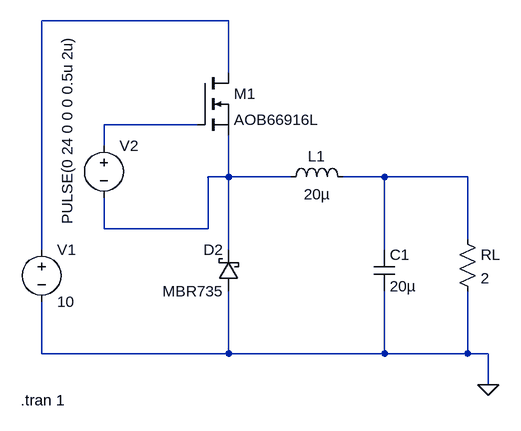
[diagram p0: schematic Buck Converter Open Loop.asc]
Buck Converter Open Loop.asc, the LTspice schematic file:
Version 4
SHEET 1 880 756
WIRE 320 -224 32 -224
WIRE 320 -144 320 -224
WIRE 272 -64 128 -64
WIRE 128 -32 128 -64
WIRE 320 16 320 -48
WIRE 320 16 288 16
WIRE 416 16 320 16
WIRE 560 16 496 16
WIRE 688 16 560 16
WIRE 128 96 128 48
WIRE 288 96 288 16
WIRE 288 96 128 96
WIRE 688 112 688 16
WIRE 32 128 32 -224
WIRE 320 128 320 16
WIRE 560 128 560 16
WIRE 32 288 32 208
WIRE 320 288 320 192
WIRE 320 288 32 288
WIRE 560 288 560 192
WIRE 560 288 320 288
WIRE 688 288 688 192
WIRE 688 288 560 288
WIRE 720 288 688 288
WIRE 720 336 720 288
FLAG 720 336 0
SYMBOL voltage 32 112 R0
WINDOW 123 0 0 Left 0
WINDOW 39 0 0 Left 0
SYMATTR InstName V1
SYMATTR Value 10
SYMBOL ind 400 32 R270
WINDOW 0 32 56 VTop 2
WINDOW 3 5 56 VBottom 2
SYMATTR InstName L1
SYMATTR Value 20µ
SYMBOL cap 544 128 R0
SYMATTR InstName C1
SYMATTR Value 20µ
SYMBOL res 672 96 R0
SYMATTR InstName RL
SYMATTR Value 2
SYMBOL schottky 336 192 R180
WINDOW 0 24 64 Left 2
WINDOW 3 24 0 Left 2
SYMATTR InstName D2
SYMATTR Value MBR735
SYMBOL nmos 272 -144 R0
SYMATTR InstName M1
SYMATTR Value AOB66916L
SYMBOL voltage 128 -48 R0
WINDOW 3 -56 137 VLeft 2
WINDOW 123 0 0 Left 0
WINDOW 39 0 0 Left 0
SYMATTR InstName V2
SYMATTR Value PULSE(0 24 0 0 0 0.5u 2u)
TEXT 0 360 Left 2 !.tran 1

The netlist it stands for:
* Buck Converter Open Loop.asc
V1 N001 0 10
L1 N003 N004 20µ
C1 N004 0 20µ
RL N004 0 2
D2 0 N003 MBR735
M1 N001 N002 N003 N003 AOB66916L
V2 N002 N003 PULSE(0 24 0 0 0 0.5u 2u)
.model D D
.lib standard.dio
.model NMOS NMOS
.model PMOS PMOS
.lib standard.mos
.tran 1
.backanno
.end